# Altium schematic sheet SODIMM.SchDoc
size C; DocumentNumber: 2; SheetNumber: 2; SheetTotal: 8
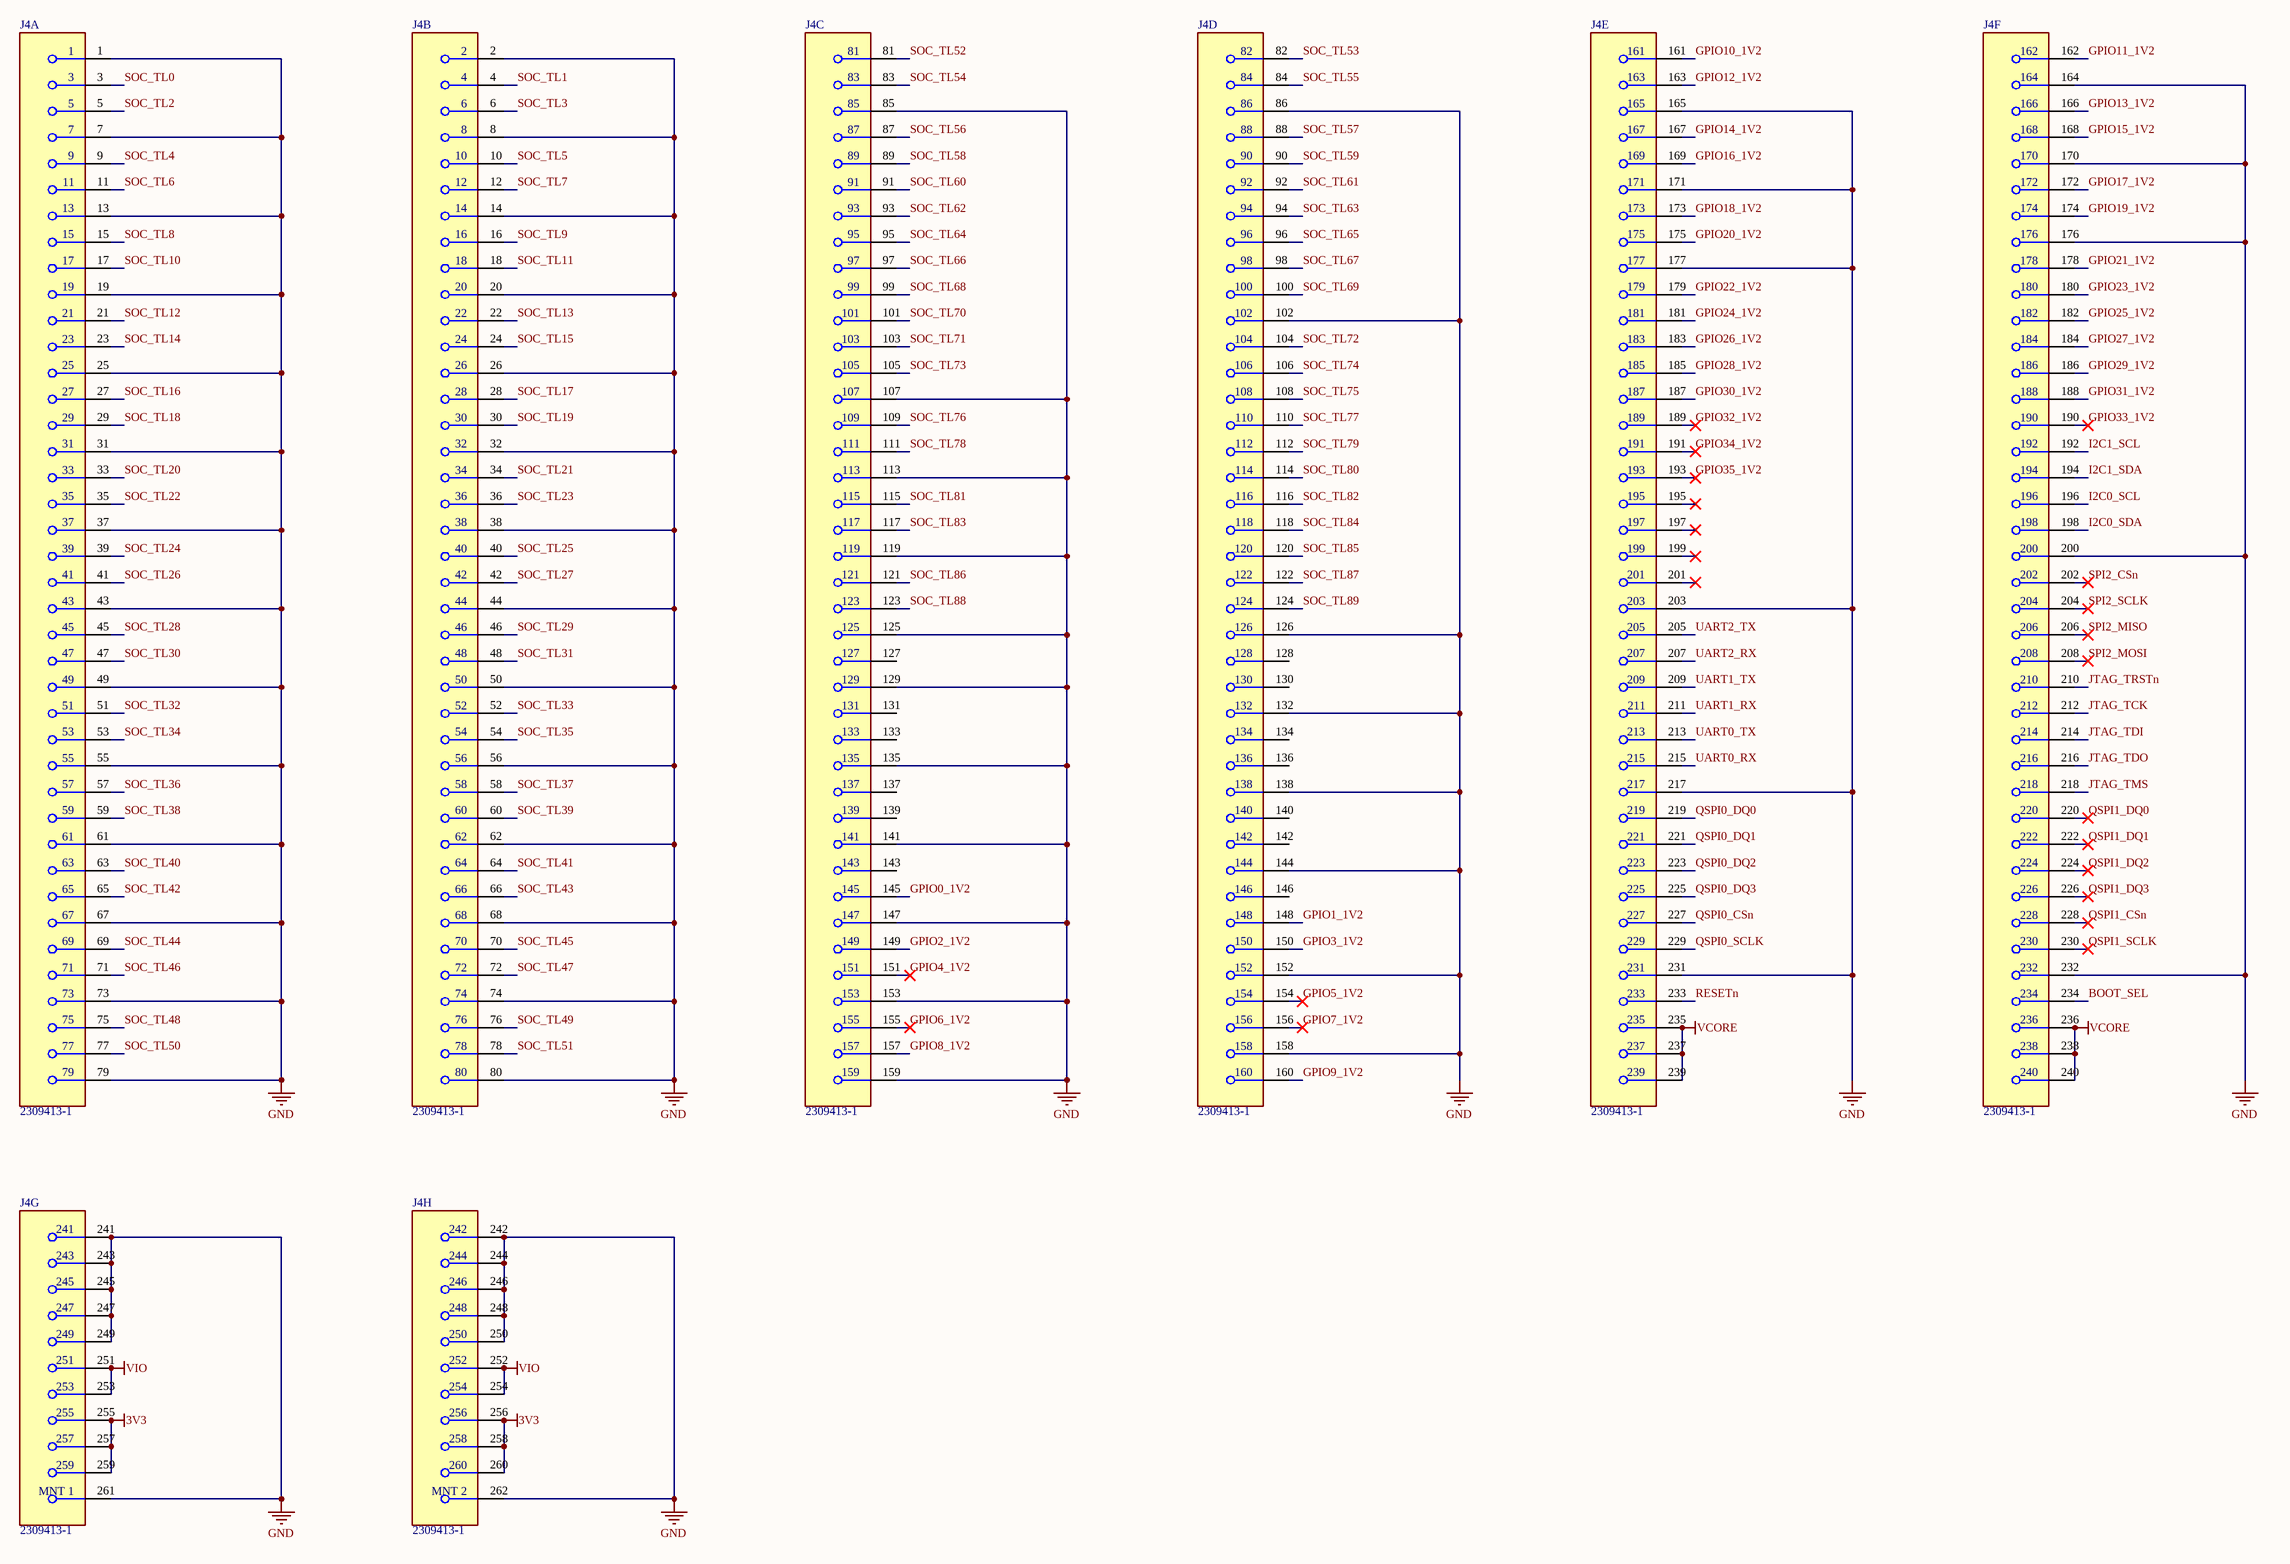
[diagram p0: SODIMM.SchDoc]

## Parts
J4  2309413-1  [FP-2309413-1-MFG]  (parts A,B,C,D,E,F,G,H of 8)

## Nets
3V3: J4.255 J4.256 J4.257 J4.258 J4.259 J4.260
GND: J4.1 J4.2 J4.7 J4.8 J4.13 J4.14 J4.19 J4.20 J4.25 J4.26 J4.31 J4.32 J4.37 J4.38 J4.43 J4.44 J4.49 J4.50 J4.55 J4.56 J4.61 J4.62 J4.67 J4.68 J4.73 J4.74 J4.79 J4.80 J4.85 J4.86 J4.102 J4.107 J4.113 J4.119 J4.125 J4.126 J4.129 J4.132 J4.135 J4.138 J4.141 J4.144 J4.147 J4.152 J4.153 J4.158 J4.159 J4.164 J4.165 J4.170 J4.171 J4.176 J4.177 J4.200 J4.203 J4.217 J4.231 J4.232 J4.241 J4.242 J4.243 J4.244 J4.245 J4.246 J4.247 J4.248 J4.249 J4.250 J4.261(MNT_1) J4.262(MNT_2)
VCORE: J4.235 J4.236 J4.237 J4.238 J4.239 J4.240
VIO: J4.251 J4.252 J4.253 J4.254
BOOT_SEL: J4.234
GPIO0_1V2: J4.145
GPIO1_1V2: J4.148
GPIO2_1V2: J4.149
GPIO3_1V2: J4.150
GPIO4_1V2: J4.151
GPIO5_1V2: J4.154
GPIO6_1V2: J4.155
GPIO7_1V2: J4.156
GPIO8_1V2: J4.157
GPIO9_1V2: J4.160
GPIO10_1V2: J4.161
GPIO11_1V2: J4.162
GPIO12_1V2: J4.163
GPIO13_1V2: J4.166
GPIO14_1V2: J4.167
GPIO15_1V2: J4.168
GPIO16_1V2: J4.169
GPIO17_1V2: J4.172
GPIO18_1V2: J4.173
GPIO19_1V2: J4.174
GPIO20_1V2: J4.175
GPIO21_1V2: J4.178
GPIO22_1V2: J4.179
GPIO23_1V2: J4.180
GPIO24_1V2: J4.181
GPIO25_1V2: J4.182
GPIO26_1V2: J4.183
GPIO27_1V2: J4.184
GPIO28_1V2: J4.185
GPIO29_1V2: J4.186
GPIO30_1V2: J4.187
GPIO31_1V2: J4.188
GPIO32_1V2: J4.189
GPIO33_1V2: J4.190
GPIO34_1V2: J4.191
GPIO35_1V2: J4.193
I2C0_SCL: J4.196
I2C0_SDA: J4.198
I2C1_SCL: J4.192
I2C1_SDA: J4.194
JTAG_TCK: J4.212
JTAG_TDI: J4.214
JTAG_TDO: J4.216
JTAG_TMS: J4.218
JTAG_TRSTn: J4.210
QSPI0_CSn: J4.227
QSPI0_DQ0: J4.219
QSPI0_DQ1: J4.221
QSPI0_DQ2: J4.223
QSPI0_DQ3: J4.225
QSPI0_SCLK: J4.229
QSPI1_CSn: J4.228
QSPI1_DQ0: J4.220
QSPI1_DQ1: J4.222
QSPI1_DQ2: J4.224
QSPI1_DQ3: J4.226
QSPI1_SCLK: J4.230
RESETn: J4.233
SOC_TL0: J4.3
SOC_TL1: J4.4
SOC_TL2: J4.5
SOC_TL3: J4.6
SOC_TL4: J4.9
SOC_TL5: J4.10
SOC_TL6: J4.11
SOC_TL7: J4.12
SOC_TL8: J4.15
SOC_TL9: J4.16
SOC_TL10: J4.17
SOC_TL11: J4.18
SOC_TL12: J4.21
SOC_TL13: J4.22
SOC_TL14: J4.23
SOC_TL15: J4.24
SOC_TL16: J4.27
SOC_TL17: J4.28
SOC_TL18: J4.29
SOC_TL19: J4.30
SOC_TL20: J4.33
SOC_TL21: J4.34
SOC_TL22: J4.35
SOC_TL23: J4.36
SOC_TL24: J4.39
SOC_TL25: J4.40
SOC_TL26: J4.41
SOC_TL27: J4.42
SOC_TL28: J4.45
SOC_TL29: J4.46
SOC_TL30: J4.47
SOC_TL31: J4.48
SOC_TL32: J4.51
SOC_TL33: J4.52
SOC_TL34: J4.53
SOC_TL35: J4.54
SOC_TL36: J4.57
SOC_TL37: J4.58
SOC_TL38: J4.59
SOC_TL39: J4.60
SOC_TL40: J4.63
SOC_TL41: J4.64
SOC_TL42: J4.65
SOC_TL43: J4.66
SOC_TL44: J4.69
SOC_TL45: J4.70
SOC_TL46: J4.71
SOC_TL47: J4.72
SOC_TL48: J4.75
SOC_TL49: J4.76
SOC_TL50: J4.77
SOC_TL51: J4.78
SOC_TL52: J4.81
SOC_TL53: J4.82
SOC_TL54: J4.83
SOC_TL55: J4.84
SOC_TL56: J4.87
SOC_TL57: J4.88
SOC_TL58: J4.89
SOC_TL59: J4.90
SOC_TL60: J4.91
SOC_TL61: J4.92
SOC_TL62: J4.93
SOC_TL63: J4.94
SOC_TL64: J4.95
SOC_TL65: J4.96
SOC_TL66: J4.97
SOC_TL67: J4.98
SOC_TL68: J4.99
SOC_TL69: J4.100
SOC_TL70: J4.101
SOC_TL71: J4.103
SOC_TL72: J4.104
SOC_TL73: J4.105
SOC_TL74: J4.106
SOC_TL75: J4.108
SOC_TL76: J4.109
SOC_TL77: J4.110
SOC_TL78: J4.111
SOC_TL79: J4.112
SOC_TL80: J4.114
SOC_TL81: J4.115
SOC_TL82: J4.116
SOC_TL83: J4.117
SOC_TL84: J4.118
SOC_TL85: J4.120
SOC_TL86: J4.121
SOC_TL87: J4.122
SOC_TL88: J4.123
SOC_TL89: J4.124
SPI2_CSn: J4.202
SPI2_MISO: J4.206
SPI2_MOSI: J4.208
SPI2_SCLK: J4.204
UART0_RX: J4.215
UART0_TX: J4.213
UART1_RX: J4.211
UART1_TX: J4.209
UART2_RX: J4.207
UART2_TX: J4.205

Not connected (* = marked no-connect by the designer): J4 127 128 130 131 133 134 136 137 139 140 142 143 146 195* 197* 199* 201*

## Library data of the parts
J4 = CMP-055-000104-3: Memory Card Connector, DDR4, SODIMM, Cam-In Locking, 260 Contacts, Copper Alloy; Manufacturer Name: TE Connectivity; Manufacturer Part Number: 2309413-1; JLC PN: C2766246